# EAGLE design C64-KeyboardTester (EAGLE 9.6.2)
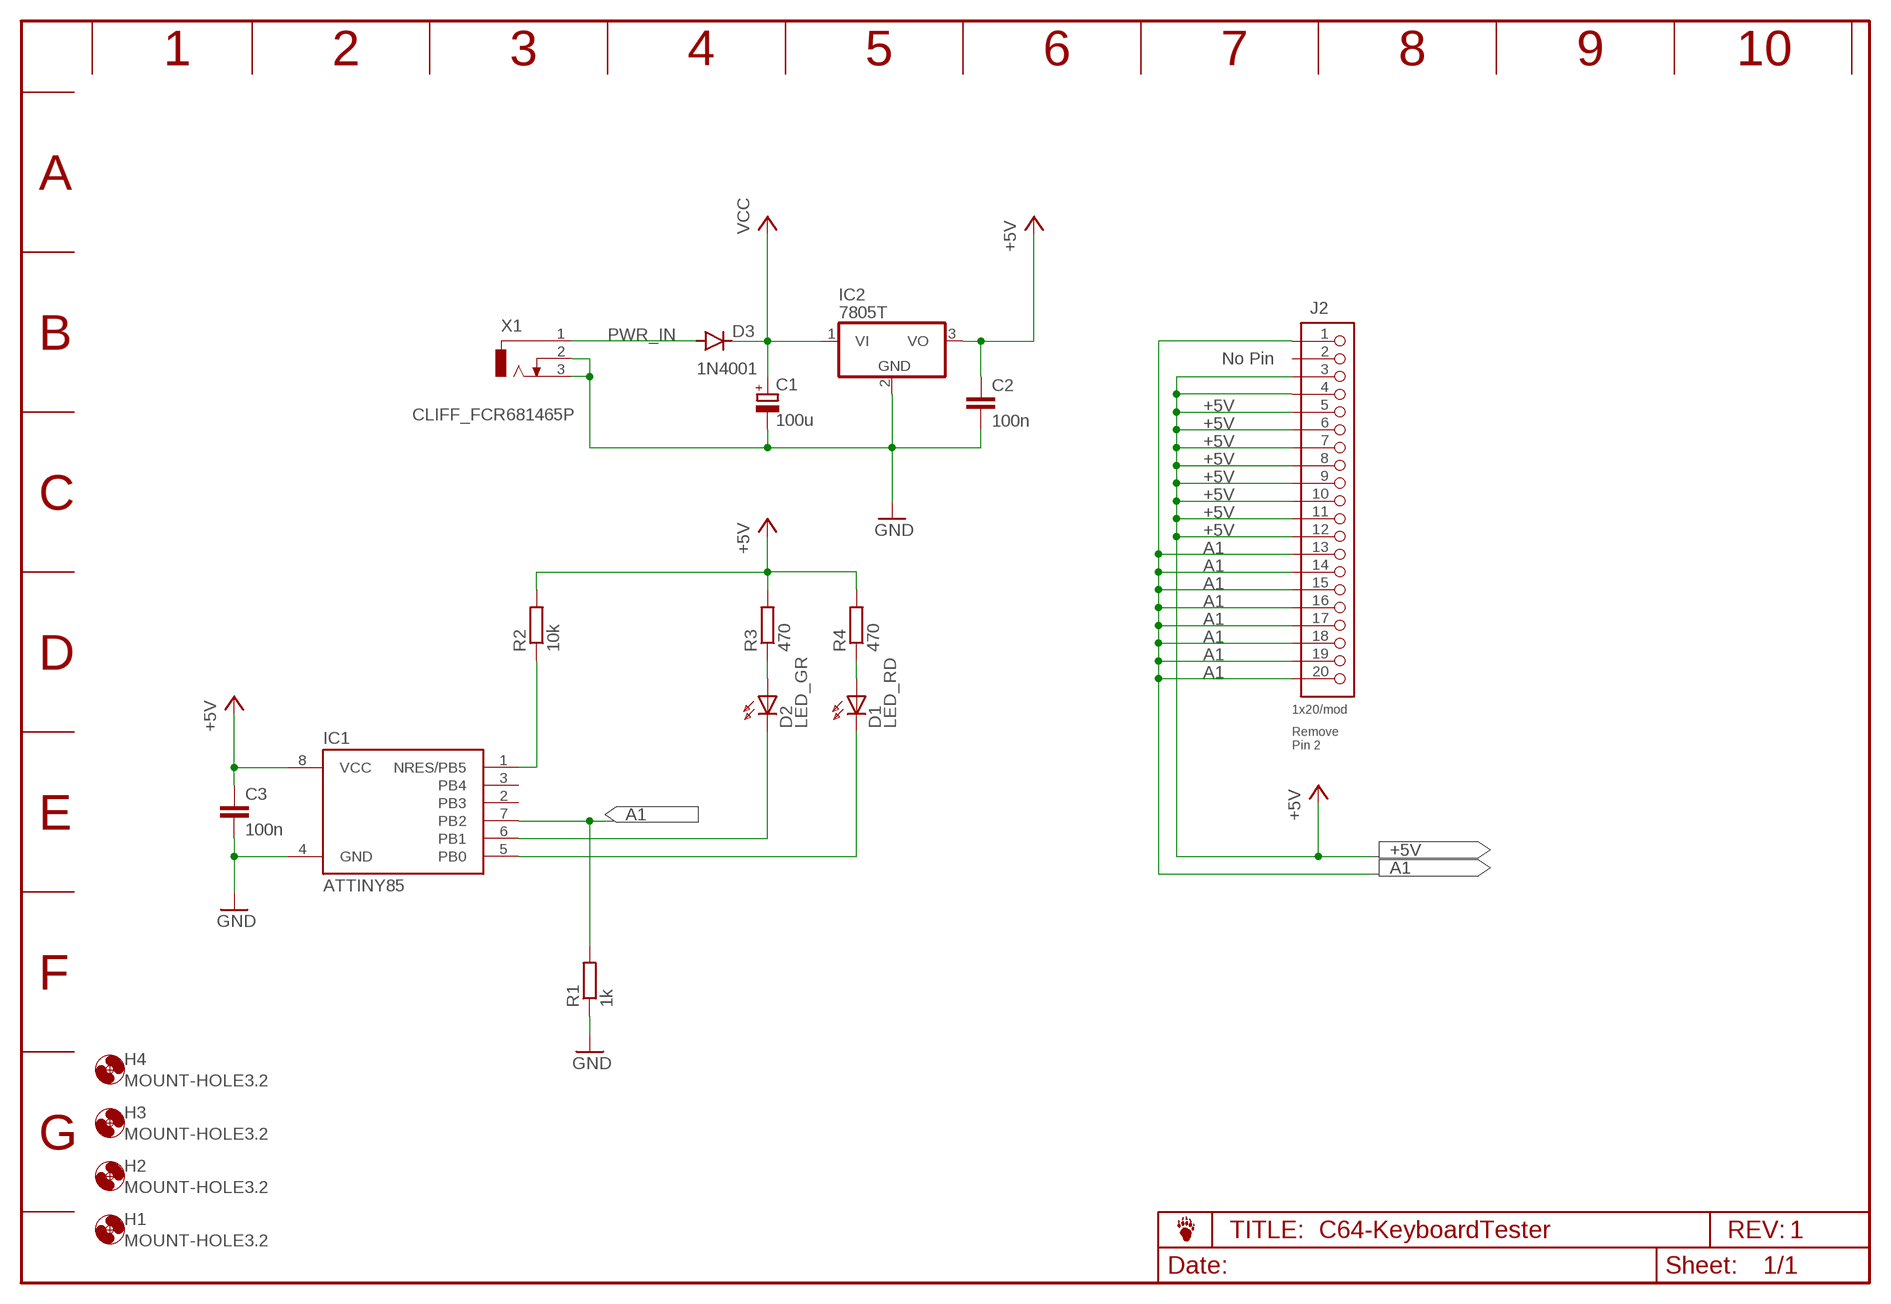
[diagram p0: schematic, sheet 1]

## Parts
C1  100u  CPOL-EUE2.5-6  [E2,5-6]
C2  100n  C-EU025-024X044  [C025-024X044]
C3  100n  C-EU025-024X044  [C025-024X044]
D1  LED_RD  LED3MMS  [LED3MM]
D2  LED_GR  LED3MMS  [LED3MM]
D3  1N4001  1N4004  [DO41-10]
H1  MOUNT-HOLE3.2  [3,2]
H2  MOUNT-HOLE3.2  [3,2]
H3  MOUNT-HOLE3.2  [3,2]
H4  MOUNT-HOLE3.2  [3,2]
IC1  ATTINY85  ATTINY85-P  [PDIP08_300MIL]
IC2  7805T  [TO220H]
J2  1x20/mod  PINHD-1X20  [1X20]
R1  1k  R-EU_0207/10  [0207/10]
R2  10k  R-EU_0207/10  [0207/10]
R3  470  R-EU_0207/10  [0207/10]
R4  470  R-EU_0207/10  [0207/10]
X1  CLIFF_FCR681465P  [FCR681465P]

## Nets
+5V: C2.1 C3.1 IC1.8(VCC) IC2.3(VO) J2.3 J2.4 J2.5 J2.6 J2.7 J2.8 J2.9 J2.10 J2.11 J2.12 R2.2 R3.2 R4.2
A1: IC1.7(PB2) J2.1 J2.13 J2.14 J2.15 J2.16 J2.17 J2.18 J2.19 J2.20 R1.2
GND: C1.- C2.2 C3.2 IC1.4(GND) IC2.2(GND) R1.1 X1.2 X1.3
N$1: D1.K(C) IC1.5(PB0)
N$3: D2.K(C) IC1.6(PB1)
N$4: IC1.1(NRES/PB5) R2.1
N$5: D2.A R3.1
N$6: D1.A R4.1
PWR_IN: D3.A X1.1
VCC: C1.+ D3.C IC2.1(VI)
Unconnected: IC1.2(PB3) IC1.3(PB4) J2.2

## Notes on the sheet
- No Pin
- Remove
  Pin 2
- 1

## Library data of the parts
C1 = rcl_bb:CPOL-EU: POLARIZED CAPACITOR, European symbol
C2 C3 = rcl_bb:C-EU: CAPACITOR, European symbol
D1 D2 = Led_bb:LED3MM: LED 3 mm, round
D3 = Me-I-Gro_bb:1N4004: DIODE general purpose rectifier, 1 A
H1-H4 = holes_bb:MOUNT-HOLE: MOUNTING HOLE with drill center marker
IC1 = attiny25_45_85_bb:ATTINY85*: ATMEL ATtiny 85 Packages: P = PDIP 08 30mil S = SOIC 08 EIAJ 208mil Technologies Note: for complete ordering code (temp. range, finish, tape&reel etc.) see www.atmel.com • Supply Voltage: V = (1.8…5.5)V | [blank] = (2.7…5.5)V • Speed: 10 = 10 MHz | 20 = 20 MHz Author: Dipl.-Ing. FH Rainer Bayer HHN Hochschule Heilbronn (Heilbronn University), rainer.bayer@hs-heilbronn.de Ingenieurbüro ing-rb, mail@ing-rb.de
IC2 = Me-I-Gro_bb:78*: Positive VOLTAGE REGULATOR Source: http://cache.national.com/ds/LM/LM78L05.pdf http://www.fairchildsemi.com/ds/LM/LM7805.pdf
J2 = PINHEAD:PINHD-1X20
R1-R4 = rcl_bb:R-EU_: RESISTOR, European symbol
X1 = Me-I-Gro_bb:CLIFF_FCR681465P: DC POWER JACK Source: DCJ0202.pdf; OC_FARNELL: unknown; OC_NEWARK: unknown

## Board
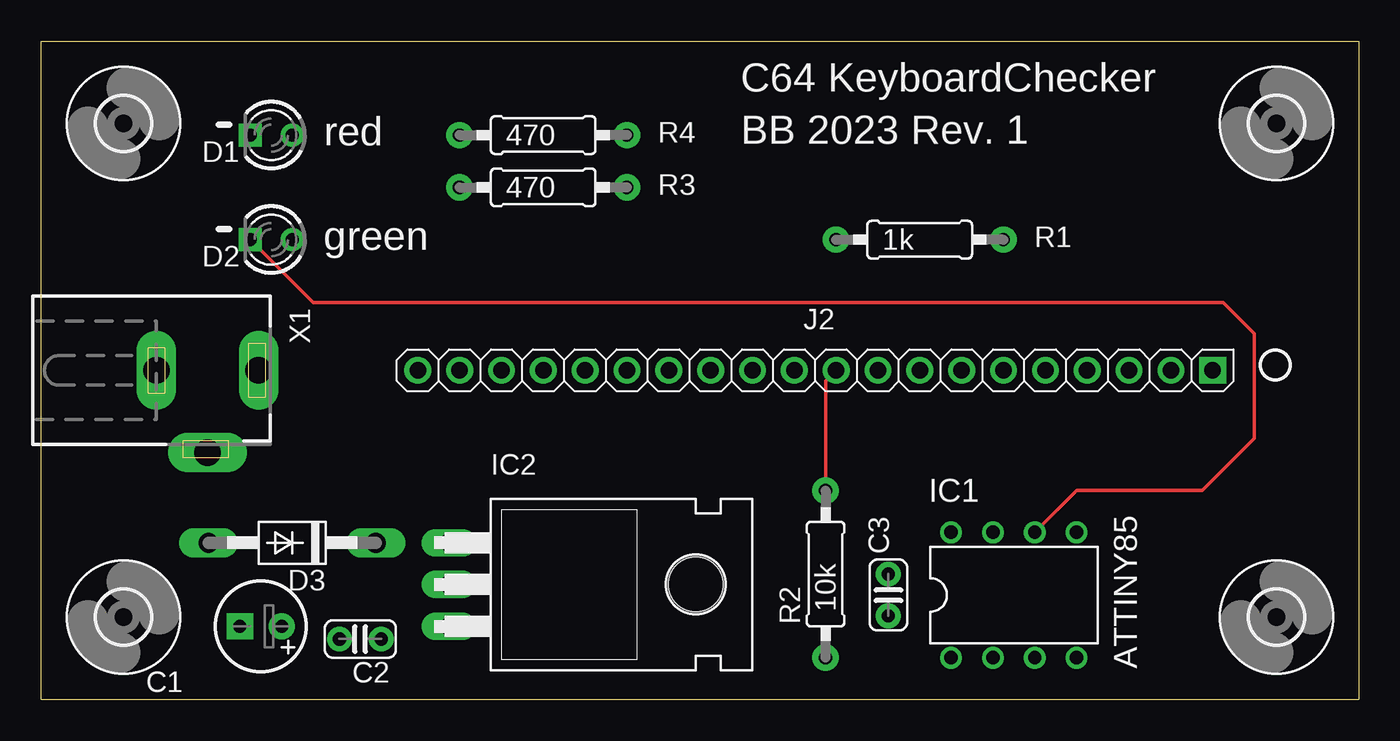
[diagram p1: board, top side]
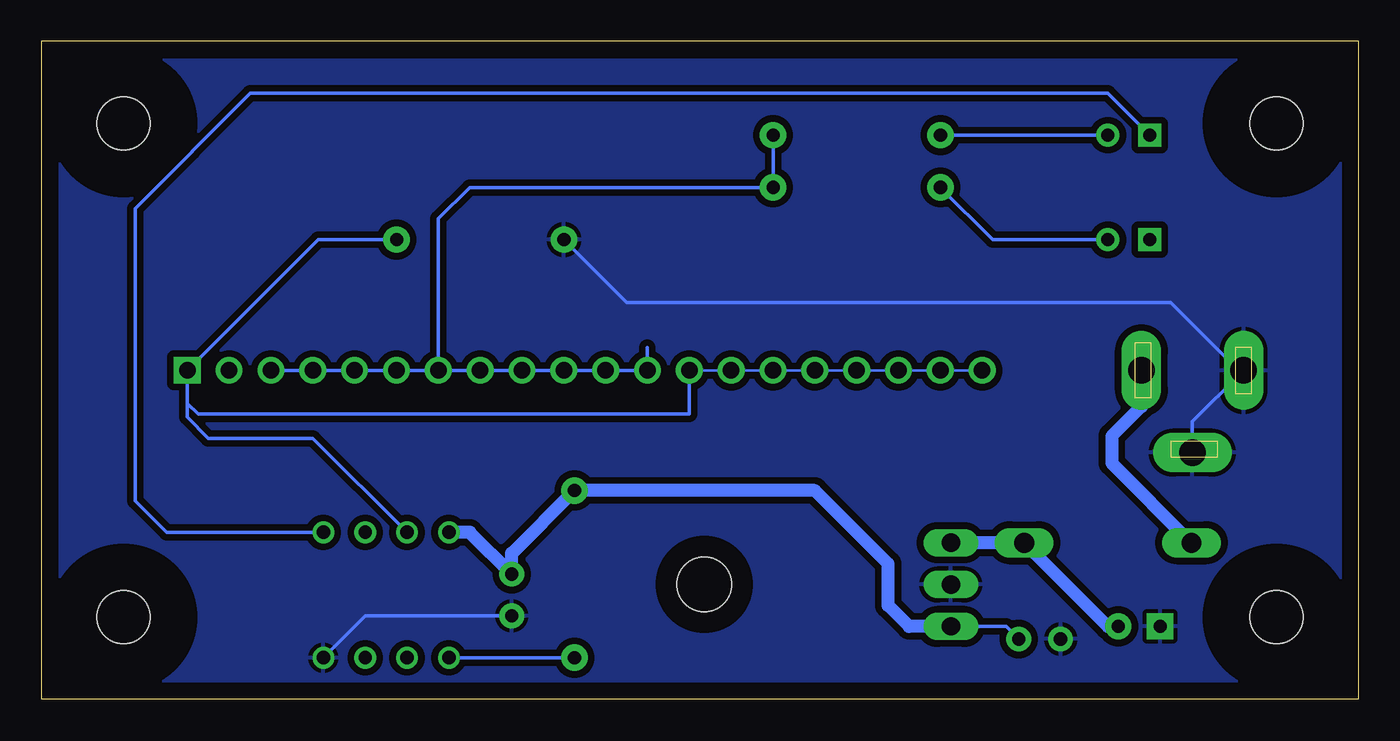
[diagram p2: board, bottom side, seen from below]

Size 80 x 40 mm. Coordinates in mm from the lower left corner, seen from the top.
Outline: 0,0 0,40 80,40 80,0 0,0
Copper layers (1*16): Top 0.035mm / dielectric 1.5mm / Bottom 0.035mm
Design rules "default": minimum track width 6mil, minimum drill 0.35mm, track to track 6mil, track to pad 6mil, pad to pad 6mil, via to via 6mil, smd to smd 6mil, copper to edge 40mil, drill to drill 6mil, minimum pad ring 10mil, minimum via ring 8mil, stop-mask expansion 4mil, vias tented up to drill 0mil, thermal gap 10mil

### Footprints (pad centres in the part's own frame; a part is rotated, then mirrored left to right if it is on the bottom)
E2,5-6 = drill 0.8 pad 1.6: + -1.27,0 | drill 0.8 pad 1.6 square: - 1.27,0
C025-024X044 = drill 0.8 pad 1.5: 1 -1.27,0; 2 1.27,0
LED3MM = drill 0.8 pad 1.4: A -1.27,0 | drill 0.8 pad 1.4 square: K 1.27,0
DO41-10 = drill 1.2 pad 1.8 long: A 5.08,0; C -5.08,0
3,2 = hole 3.2: 0,0
PDIP08_300MIL = drill 0.813: 1 -3.81,-3.81; 2 -1.27,-3.81; 3 1.27,-3.81; 4 3.81,-3.81; 5 3.81,3.81; 6 1.27,3.81; 7 -1.27,3.81; 8 -3.81,3.81
TO220H = drill 1.118 long: 1 -2.54,-10.16; 2 0,-10.16; 3 2.54,-10.16 | hole 3.302: 0,4.826
1X20 = drill 1 pad 1.626 square: 1 -24.13,0 | drill 1 pad 1.626: 2 -21.59,0; 3 -19.05,0; 4 -16.51,0; 5 -13.97,0; 6 -11.43,0; 7 -8.89,0; 8 -6.35,0; 9 -3.81,0; 10 -1.27,0; 11 1.27,0; 12 3.81,0; 13 6.35,0; 14 8.89,0; 15 11.43,0; 16 13.97,0; 17 16.51,0; 18 19.05,0; 19 21.59,0; 20 24.13,0
0207/10 = drill 0.8 pad 1.6: 1 -5.08,0; 2 5.08,0
FCR681465P = drill 1.6 pad 2.4 long: 1 0,6.2; 2 5,3.1; 3 0,0

### Placement (x,y rotation side)
C1  13.34,4.45 180 top
C2  19.38,3.67 180 top
C3  51.44,6.35 270 top
D1  13.97,34.29 180 top
D2  13.97,27.94 180 top
D3  15.24,9.53 180 top
H1  75,5 0 top
H2  5,35 0 top
H3  75,35 0 top
H4  5,5 0 top
IC1  59.05,6.35 0 top
IC2  34.92,6.99 270 top
J2  47,20 180 top
R1  53.34,27.94 0 top
R2  47.62,7.62 90 top
R3  30.48,31.11 0 top
R4  30.48,34.29 0 top
X1  7,20 270 top

### Tracks (layer width: path | path; a pad name or v marks a point on that pad's centre or on a via)
+5V
  Top 0.2: R2.2 47.62,19.36 J2.10
  Bottom 0.2: J2.3 J2.4 J2.5 J2.6 J2.7 55.24,20 | 55.24,20 J2.8 J2.9 J2.10 J2.11 J2.12 43.19,21.38 | C2.1 21.42,4.45 IC2.3 | R4.2 R3.2 53.98,31.11 55.88,29.21 55.88,20.64 55.24,20
  Bottom 0.8: IC1.8 53.98,10.16 C3.1 51.44,8.89 R2.2 33.02,12.7 28.57,8.26 28.57,5.71 27.3,4.45 IC2.3
A1
  Bottom 0.152: J2.1 71.13,18 71.13,17.82 | J2.13 J2.14 J2.15 J2.16 J2.17 J2.18 J2.19 J2.20
  Bottom 0.2: J2.13 40.65,17.34 68.85,17.34 70.47,17.34 71.13,18 | J2.1 63.19,27.94 R1.2 | J2.1 71.13,17.82 | IC1.7 63.5,15.88 69.85,15.88 71.13,17.16 J2.1
GND
  Bottom 0.2: X1.3 7.15,19.85 | 7.15,19.85 10.1,16.9 X1.2 | R1.1 44.45,24.13 11.43,24.13 7.15,19.85 | C3.2 60.33,5.08 IC1.4
  pour Bottom (isolate 0.406): 1,1 1,39 79,39 79,1
N$1
  Bottom 0.2: D1.K 15.24,36.83 67.31,36.83 70.84,33.3 70.84,33.27 74.3,29.82 74.3,12.06 72.39,10.16 IC1.5
N$3
  Top 0.2: D2.K 16.51,24.13 71.75,24.13 73.66,22.23 73.66,15.88 70.48,12.7 62.87,12.7 IC1.6
N$4
  Bottom 0.2: R2.1 IC1.1
N$5
  Bottom 0.2: R3.1 22.23,27.94 D2.A
N$6
  Bottom 0.2: R4.1 D1.A
PWR_IN
  Bottom 0.8: X1.1 13.2,17.8 15,16 15,14.37 D3.A
VCC
  Bottom 0.8: IC2.1 D3.C 15.24,4.45 C1.+

### Text on the board
tNames: C64 KeyboardChecker | red | BB 2023 Rev. 1 | green